# Altium schematic sheet Used_microcontroller.SchDoc
size A4
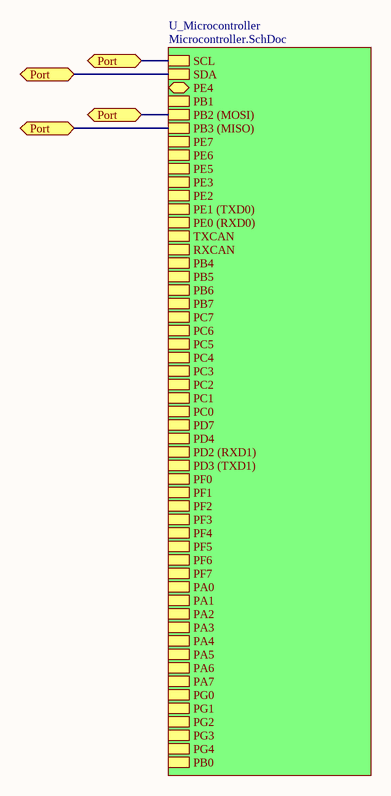
[diagram p0: Used_microcontroller.SchDoc]

## Sub-sheets
U_Microcontroller = Microcontroller.SchDoc: SCL, SDA, PE4 (bidir), PB1, PB2 (MOSI), PB3 (MISO), PE7, PE6, PE5, PE3, PE2, PE1 (TXD0), PE0 (RXD0), TXCAN, RXCAN, PB4, PB5, PB6, PB7, PC7, PC6, PC5, PC4, PC3, PC2, PC1, PC0, PD7, PD4, PD2 (RXD1), PD3 (TXD1), PF0, PF1, PF2, PF3, PF4, PF5, PF6, PF7, PA0, PA1, PA2, PA3, PA4, PA5, PA6, PA7, PG0, PG1, PG2, PG3, PG4, PB0

## Ports
Port

## Nets
Port: port Port, sheet U_Microcontroller/SCL, sheet U_Microcontroller/SDA, sheet U_Microcontroller/PB2 (MOSI), sheet U_Microcontroller/PB3 (MISO)